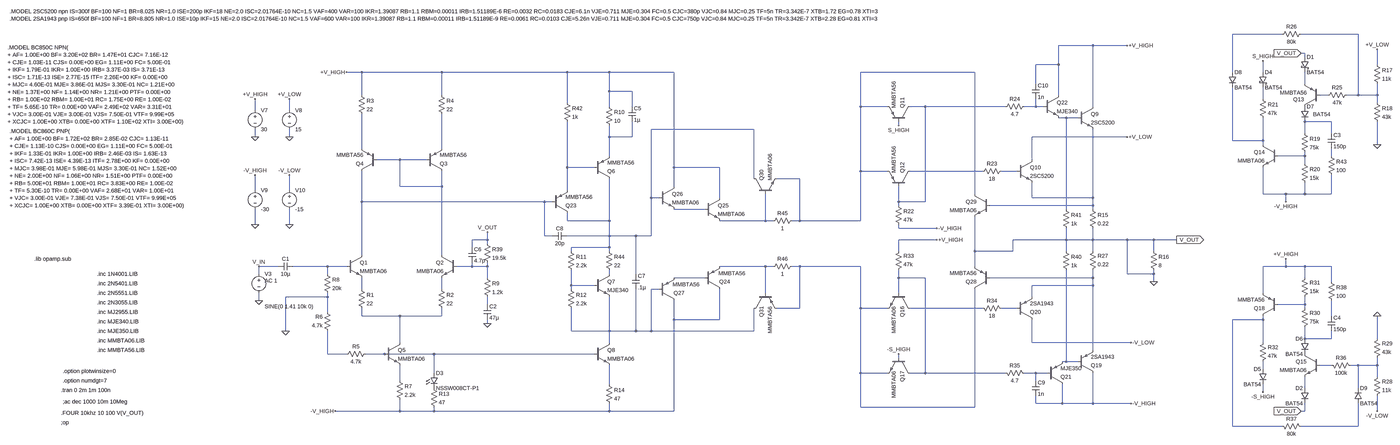
[diagram p0: schematic Limitador-Corriente.asc, whole sheet]
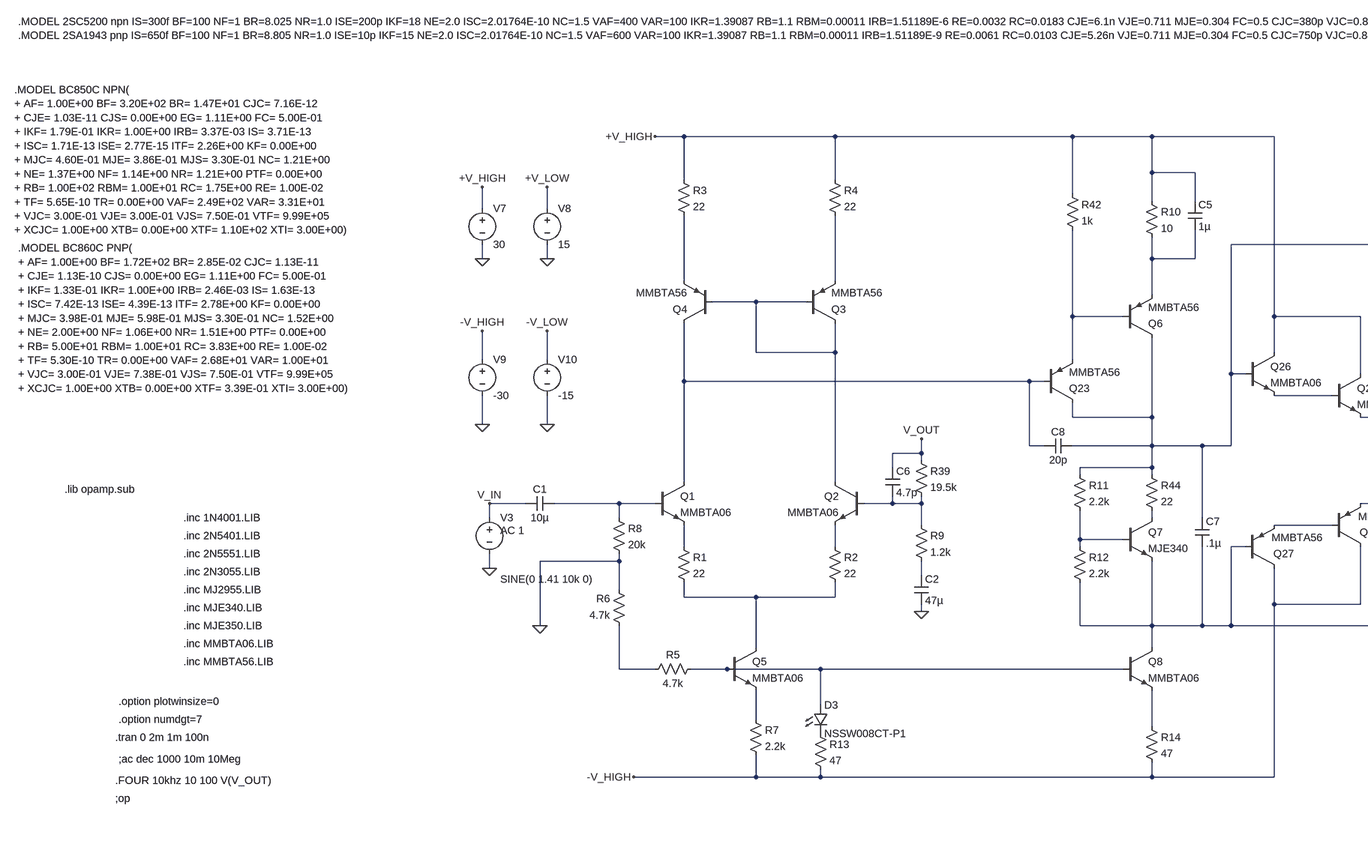
[diagram p1: schematic Limitador-Corriente.asc, part, row 1 of 1, column 1 of 2]
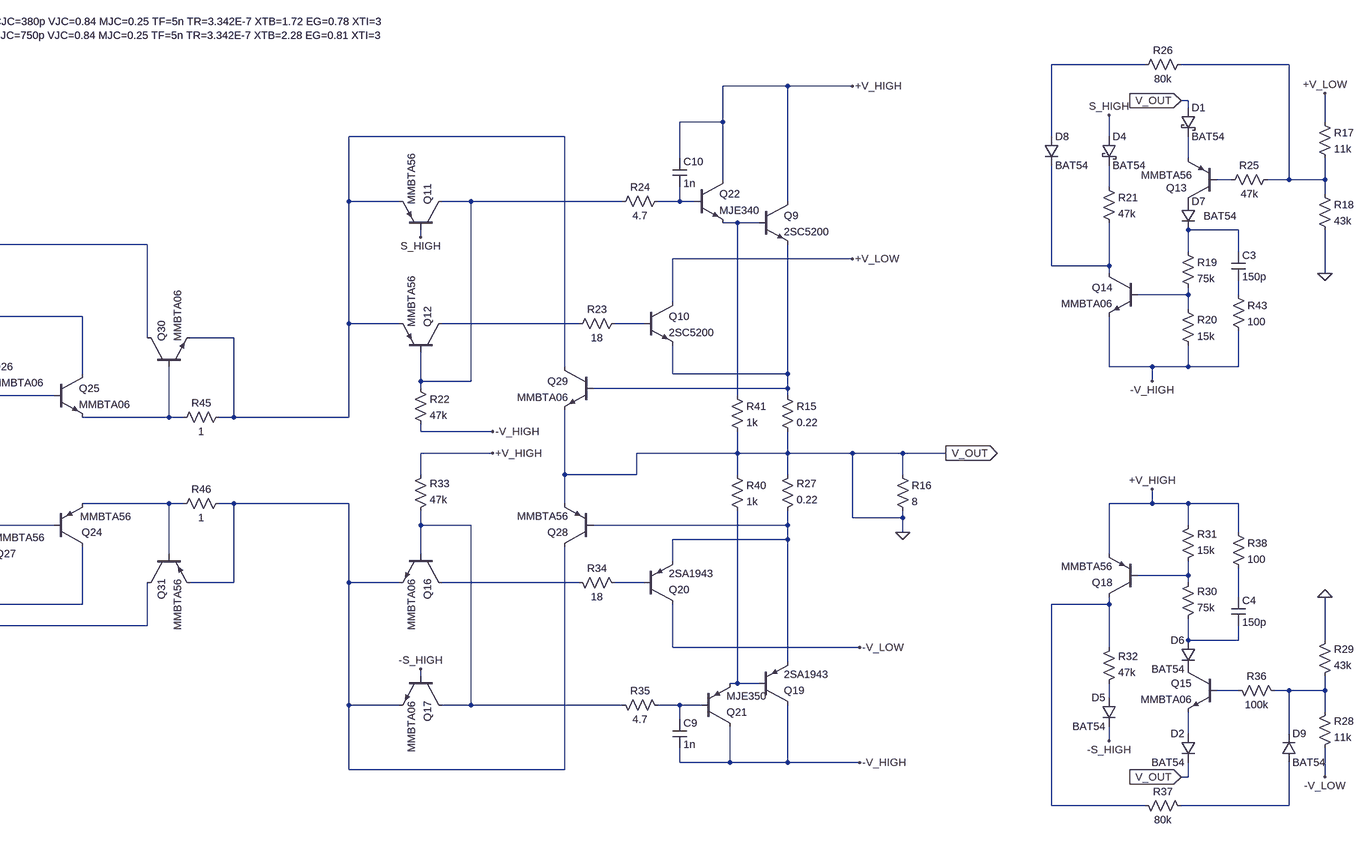
[diagram p2: schematic Limitador-Corriente.asc, part, row 1 of 1, column 2 of 2]
Limitador-Corriente.asc, the LTspice schematic file:
Version 4
SHEET 1 4660 2796
WIRE 4192 -784 3984 -784
WIRE 4512 -784 4272 -784
WIRE 3344 -736 3200 -736
WIRE 3488 -736 3344 -736
WIRE 4288 -704 4272 -704
WIRE 4288 -688 4288 -704
WIRE 3200 -656 3200 -736
WIRE 3200 -656 3104 -656
WIRE 4592 -656 4592 -720
WIRE 272 -624 208 -624
WIRE 608 -624 272 -624
WIRE 1136 -624 608 -624
WIRE 1312 -624 1136 -624
WIRE 1584 -624 1312 -624
WIRE 2848 -624 2368 -624
WIRE 3984 -624 3984 -784
WIRE 4112 -624 4112 -672
WIRE 3104 -576 3104 -656
WIRE 4288 -576 4288 -624
WIRE 1312 -544 1312 -624
WIRE 1408 -544 1312 -544
WIRE 272 -528 272 -624
WIRE 608 -528 608 -624
WIRE 3200 -528 3200 -656
WIRE 4384 -528 4352 -528
WIRE 4512 -528 4512 -784
WIRE 4512 -528 4464 -528
WIRE 4592 -528 4592 -576
WIRE 4592 -528 4512 -528
WIRE 4112 -512 4112 -560
WIRE 1136 -496 1136 -624
WIRE 4592 -496 4592 -528
WIRE 1312 -480 1312 -544
WIRE 1408 -480 1408 -544
WIRE 2368 -480 2368 -624
WIRE 2480 -480 2368 -480
WIRE 2640 -480 2576 -480
WIRE 2976 -480 2640 -480
WIRE 3104 -480 3104 -512
WIRE 3104 -480 3056 -480
WIRE 3136 -480 3104 -480
WIRE 3344 -480 3344 -736
WIRE -176 -464 -176 -512
WIRE -32 -464 -32 -512
WIRE 3232 -432 3200 -432
WIRE 3280 -432 3232 -432
WIRE 4400 -416 4288 -416
WIRE 2528 -400 2528 -416
WIRE 1920 -384 1488 -384
WIRE 4288 -368 4288 -416
WIRE 4400 -368 4400 -416
WIRE -176 -352 -176 -384
WIRE -32 -352 -32 -384
WIRE 1312 -352 1312 -400
WIRE 1408 -352 1408 -416
WIRE 1408 -352 1312 -352
WIRE 3488 -352 3088 -352
WIRE 3984 -336 3984 -560
WIRE 4112 -336 4112 -432
WIRE 4112 -336 3984 -336
WIRE 4112 -320 4112 -336
WIRE 4592 -320 4592 -416
WIRE 272 -304 272 -448
WIRE 608 -304 608 -448
WIRE 1312 -272 1312 -352
WIRE 4288 -272 4288 -288
WIRE 4288 -272 4176 -272
WIRE 4400 -272 4400 -304
WIRE 432 -256 336 -256
WIRE 544 -256 432 -256
WIRE 3088 -256 3088 -352
WIRE 4288 -240 4288 -272
WIRE 1136 -224 1136 -416
WIRE 1248 -224 1136 -224
WIRE 1584 -224 1584 -624
WIRE 1776 -224 1584 -224
WIRE 2368 -208 2368 -480
WIRE 2480 -208 2368 -208
WIRE 2880 -208 2576 -208
WIRE 3024 -208 2960 -208
WIRE 1920 -176 1920 -384
WIRE 2112 -176 2016 -176
WIRE 432 -144 432 -256
WIRE 608 -144 608 -208
WIRE 608 -144 432 -144
WIRE 1584 -144 1584 -224
WIRE -176 -128 -176 -192
WIRE -32 -128 -32 -192
WIRE 1136 -128 1136 -224
WIRE 2848 -112 2848 -624
WIRE 4112 -112 4112 -224
WIRE 4208 -112 4112 -112
WIRE 4288 -112 4288 -160
WIRE 4288 -112 4208 -112
WIRE 4400 -112 4400 -192
WIRE 4400 -112 4288 -112
WIRE 1488 -96 1488 -384
WIRE 1520 -96 1488 -96
WIRE 1776 -96 1776 -224
WIRE 3088 -96 3088 -160
WIRE 3344 -96 3344 -384
WIRE 3344 -96 3088 -96
WIRE 272 -80 272 -208
WIRE 1040 -80 272 -80
WIRE 1072 -80 1040 -80
WIRE 2528 -80 2528 -144
WIRE 2640 -80 2640 -480
WIRE 2640 -80 2528 -80
WIRE 4208 -80 4208 -112
WIRE 2528 -64 2528 -80
WIRE 3344 -64 3344 -96
WIRE 3344 -64 2912 -64
WIRE 1712 -48 1584 -48
WIRE 3232 -48 3232 -432
WIRE 3344 -48 3344 -64
WIRE 1136 0 1136 -32
WIRE 1312 0 1312 -176
WIRE 1312 0 1136 0
WIRE 1968 0 1968 -112
WIRE 1968 0 1776 0
WIRE 2000 0 1968 0
WIRE 2112 0 2112 -176
WIRE 2112 0 2080 0
WIRE 2368 0 2368 -208
WIRE 2368 0 2112 0
WIRE -176 16 -176 -48
WIRE -32 16 -32 -48
WIRE 2528 32 2528 16
WIRE 2688 32 2528 32
WIRE 1040 64 1040 -80
WIRE 1072 64 1040 64
WIRE 1312 64 1312 0
WIRE 1312 64 1136 64
WIRE 1424 64 1312 64
WIRE 1488 64 1488 -96
WIRE 1488 64 1424 64
WIRE 800 80 800 48
WIRE 800 80 736 80
WIRE 2688 80 2528 80
WIRE 3232 80 3232 32
WIRE 3232 80 3008 80
WIRE 3344 80 3344 32
WIRE 3344 80 3232 80
WIRE 3488 80 3344 80
WIRE 3600 80 3488 80
WIRE 3696 80 3600 80
WIRE 800 96 800 80
WIRE 736 112 736 80
WIRE 1312 112 1312 64
WIRE 1312 112 1152 112
WIRE 1152 128 1152 112
WIRE 1312 128 1312 112
WIRE 2528 128 2528 80
WIRE 2848 128 2848 -16
WIRE 3008 128 3008 80
WIRE 3008 128 2848 128
WIRE 3232 128 3232 80
WIRE 3344 128 3344 80
WIRE 3600 128 3600 80
WIRE 272 144 272 -80
WIRE 608 144 608 -144
WIRE -80 192 -160 192
WIRE 128 192 -16 192
WIRE 208 192 128 192
WIRE 736 192 736 176
WIRE 736 192 672 192
WIRE 800 192 800 176
WIRE 800 192 736 192
WIRE 1968 192 1776 192
WIRE 2000 192 1968 192
WIRE 2112 192 2080 192
WIRE 2368 192 2112 192
WIRE 2848 192 2848 128
WIRE 4208 192 4208 160
WIRE 4208 192 4112 192
WIRE 4288 192 4208 192
WIRE 4400 192 4288 192
WIRE -160 224 -160 192
WIRE 128 224 128 192
WIRE 1312 224 1312 208
WIRE 1424 224 1424 64
WIRE 3488 224 3488 80
WIRE 3600 224 3600 208
WIRE 3600 224 3488 224
WIRE 800 240 800 192
WIRE 1712 240 1584 240
WIRE 2528 240 2528 208
WIRE 2640 240 2528 240
WIRE 3344 240 3344 208
WIRE 3344 240 2912 240
WIRE 4288 240 4288 192
WIRE 3600 256 3600 224
WIRE 4400 256 4400 192
WIRE 1152 272 1152 208
WIRE 1248 272 1152 272
WIRE 3344 272 3344 240
WIRE 3344 272 3088 272
WIRE 272 288 272 240
WIRE 608 288 608 240
WIRE 1152 288 1152 272
WIRE 1520 288 1488 288
WIRE 1968 304 1968 192
WIRE 2528 304 2528 240
WIRE 4112 304 4112 192
WIRE 128 320 128 304
WIRE 128 320 -48 320
WIRE 3088 320 3088 272
WIRE -160 336 -160 304
WIRE 800 352 800 320
WIRE 4288 352 4288 320
WIRE 4288 352 4176 352
WIRE 2112 368 2112 192
WIRE 2112 368 2016 368
WIRE 2368 368 2368 192
WIRE 2480 368 2368 368
WIRE 2880 368 2576 368
WIRE 3024 368 2960 368
WIRE 4288 368 4288 352
WIRE 128 384 128 320
WIRE 272 400 272 368
WIRE 432 400 272 400
WIRE 608 400 608 368
WIRE 608 400 432 400
WIRE 4400 400 4400 336
WIRE 1584 416 1584 336
WIRE 1776 416 1776 288
WIRE 1776 416 1584 416
WIRE 4112 416 4112 400
WIRE 4112 416 3984 416
WIRE 800 432 800 416
WIRE -48 464 -48 320
WIRE 1152 464 1152 368
WIRE 1312 464 1312 320
WIRE 1312 464 1152 464
WIRE 1424 464 1424 288
WIRE 1424 464 1312 464
WIRE 1488 464 1488 288
WIRE 1488 464 1424 464
WIRE 1920 464 1920 368
WIRE 1920 464 1488 464
WIRE 4288 496 4288 448
WIRE 4400 496 4400 464
WIRE 4400 496 4288 496
WIRE 4592 496 4592 400
WIRE 432 512 432 400
WIRE 1312 512 1312 464
WIRE 3088 512 3088 416
WIRE 3504 512 3088 512
WIRE 4112 512 4112 416
WIRE 3344 544 3344 272
WIRE 128 560 128 464
WIRE 208 560 128 560
WIRE 368 560 288 560
WIRE 576 560 368 560
WIRE 1248 560 576 560
WIRE 2528 576 2528 560
WIRE 3232 592 3232 208
WIRE 3232 592 3216 592
WIRE 3280 592 3232 592
WIRE 4400 608 4352 608
WIRE 4512 608 4480 608
WIRE 4592 608 4592 576
WIRE 4592 608 4512 608
WIRE 4112 624 4112 592
WIRE 576 640 576 560
WIRE 2368 640 2368 368
WIRE 2480 640 2368 640
WIRE 2640 640 2640 240
WIRE 2640 640 2576 640
WIRE 2976 640 2640 640
WIRE 3104 640 3056 640
WIRE 3152 640 3104 640
WIRE 4592 656 4592 608
WIRE 432 672 432 608
WIRE 3104 672 3104 640
WIRE 1312 688 1312 608
WIRE 4288 704 4288 656
WIRE 4512 704 4512 608
WIRE 4112 720 4112 688
WIRE 3104 768 3104 736
WIRE 3216 768 3216 688
WIRE 3216 768 3104 768
WIRE 3344 768 3344 640
WIRE 3344 768 3216 768
WIRE 3504 768 3344 768
WIRE 2368 784 2368 640
WIRE 2848 784 2848 288
WIRE 2848 784 2368 784
WIRE 432 800 432 752
WIRE 432 800 160 800
WIRE 576 800 576 784
WIRE 576 800 432 800
WIRE 1312 800 1312 768
WIRE 1312 800 576 800
WIRE 1584 800 1584 416
WIRE 1584 800 1312 800
WIRE 4288 800 4288 768
WIRE 4288 800 4272 800
WIRE 4592 800 4592 736
WIRE 3984 864 3984 416
WIRE 4192 864 3984 864
WIRE 4512 864 4512 768
WIRE 4512 864 4272 864
FLAG -48 464 0
FLAG 800 432 0
FLAG -160 336 0
FLAG 3488 -736 +V_HIGH
FLAG 3488 -352 +V_LOW
FLAG 3600 256 0
FLAG 4592 -320 0
FLAG 4592 -720 +V_LOW
FLAG 3696 80 V_OUT
IOPIN 3696 80 Out
FLAG 4272 -704 V_OUT
IOPIN 4272 -704 In
FLAG 4208 -80 -V_HIGH
FLAG 2528 -400 S_HIGH
FLAG 4112 -672 S_HIGH
FLAG 2688 32 -V_HIGH
FLAG 3504 768 -V_HIGH
FLAG 3504 512 -V_LOW
FLAG 4592 400 0
FLAG 4592 800 -V_LOW
FLAG 4272 800 V_OUT
IOPIN 4272 800 In
FLAG 4208 160 +V_HIGH
FLAG 2528 560 -S_HIGH
FLAG 4112 720 -S_HIGH
FLAG 2688 80 +V_HIGH
FLAG -176 -352 0
FLAG -32 -352 0
FLAG -176 -512 +V_HIGH
FLAG -32 -512 +V_LOW
FLAG -176 16 0
FLAG -32 16 0
FLAG -176 -192 -V_HIGH
FLAG -32 -192 -V_LOW
FLAG 208 -624 +V_HIGH
FLAG 160 800 -V_HIGH
FLAG 800 48 V_OUT
FLAG -160 192 V_IN
SYMBOL npn 208 144 R0
SYMATTR InstName Q1
SYMATTR Value MMBTA06
SYMBOL npn 672 144 M0
SYMATTR InstName Q2
SYMATTR Value MMBTA06
SYMBOL pnp 544 -208 M180
SYMATTR InstName Q3
SYMATTR Value MMBTA56
SYMBOL pnp 336 -208 R180
SYMATTR InstName Q4
SYMATTR Value MMBTA56
SYMBOL res 256 272 R0
SYMATTR InstName R1
SYMATTR Value 22
SYMBOL res 592 272 R0
SYMATTR InstName R2
SYMATTR Value 22
SYMBOL res 256 -544 R0
SYMATTR InstName R3
SYMATTR Value 22
SYMBOL res 592 -544 R0
SYMATTR InstName R4
SYMATTR Value 22
SYMBOL npn 368 512 R0
SYMATTR InstName Q5
SYMATTR Value MMBTA06
SYMBOL res 304 544 R90
WINDOW 0 0 56 VBottom 2
WINDOW 3 32 56 VTop 2
SYMATTR InstName R5
SYMATTR Value 4.7k
SYMBOL res 144 480 R180
WINDOW 0 36 76 Left 2
WINDOW 3 36 40 Left 2
SYMATTR InstName R6
SYMATTR Value 4.7k
SYMBOL res 416 656 R0
SYMATTR InstName R7
SYMATTR Value 2.2k
SYMBOL res 112 208 R0
SYMATTR InstName R8
SYMATTR Value 20k
SYMBOL res 784 224 R0
SYMATTR InstName R9
SYMATTR Value 1.2k
SYMBOL cap -16 176 R90
WINDOW 0 0 32 VBottom 2
WINDOW 3 32 32 VTop 2
SYMATTR InstName C1
SYMATTR Value 10µ
SYMBOL voltage -160 208 R0
WINDOW 3 24 152 Left 2
WINDOW 123 24 44 Left 2
WINDOW 39 0 0 Left 0
SYMATTR Value SINE(0 1.41 10k 0)
SYMATTR Value2 AC 1
SYMATTR InstName V3
SYMBOL pnp 1248 -176 M180
SYMATTR InstName Q6
SYMATTR Value MMBTA56
SYMBOL res 1296 -496 R0
SYMATTR InstName R10
SYMATTR Value 10
SYMBOL npn 1248 224 R0
SYMATTR InstName Q7
SYMATTR Value MJE340
SYMBOL res 1136 112 R0
SYMATTR InstName R11
SYMATTR Value 2.2k
SYMBOL res 1136 272 R0
SYMATTR InstName R12
SYMATTR Value 2.2k
SYMBOL npn 1248 512 R0
SYMATTR InstName Q8
SYMATTR Value MMBTA06
SYMBOL res 1296 672 R0
SYMATTR InstName R14
SYMATTR Value 47
SYMBOL cap 784 352 R0
SYMATTR InstName C2
SYMATTR Value 47µ
SYMBOL npn 3280 -480 R0
SYMATTR InstName Q9
SYMATTR Value 2SC5200
SYMBOL npn 3024 -256 R0
SYMATTR InstName Q10
SYMATTR Value 2SC5200
SYMBOL res 3328 -64 R0
SYMATTR InstName R15
SYMATTR Value 0.22
SYMBOL pnp 2576 -416 M270
SYMATTR InstName Q11
SYMATTR Value MMBTA56
SYMBOL pnp 2576 -144 M270
SYMATTR InstName Q12
SYMATTR Value MMBTA56
SYMBOL res 3584 112 R0
SYMATTR InstName R16
SYMATTR Value 8
SYMBOL res 4576 -672 R0
SYMATTR InstName R17
SYMATTR Value 11k
SYMBOL res 4576 -512 R0
SYMATTR InstName R18
SYMATTR Value 43k
SYMBOL pnp 4352 -480 R180
WINDOW 0 67 30 Left 2
WINDOW 3 55 58 Left 2
SYMATTR InstName Q13
SYMATTR Value MMBTA56
SYMBOL res 4272 -384 R0
SYMATTR InstName R19
SYMATTR Value 75k
SYMBOL res 4272 -256 R0
SYMATTR InstName R20
SYMATTR Value 15k
SYMBOL npn 4176 -320 M0
SYMATTR InstName Q14
SYMATTR Value MMBTA06
SYMBOL res 4096 -528 R0
SYMATTR InstName R21
SYMATTR Value 47k
SYMBOL res 2512 -80 R0
SYMATTR InstName R22
SYMATTR Value 47k
SYMBOL cap 4384 -368 R0
SYMATTR InstName C3
SYMATTR Value 150p
SYMBOL schottky 4272 -688 R0
SYMATTR InstName D1
SYMATTR Value BAT54
SYMATTR Description Diode
SYMATTR Type diode
SYMBOL res 2976 -224 R90
WINDOW 0 0 56 VBottom 2
WINDOW 3 32 56 VTop 2
SYMATTR InstName R23
SYMATTR Value 18
SYMBOL res 3072 -496 R90
WINDOW 0 0 56 VBottom 2
WINDOW 3 32 56 VTop 2
SYMATTR InstName R24
SYMATTR Value 4.7
SYMBOL res 4480 -544 R90
WINDOW 0 0 56 VBottom 2
WINDOW 3 32 56 VTop 2
SYMATTR InstName R25
SYMATTR Value 47k
SYMBOL res 4288 -800 R90
WINDOW 0 0 56 VBottom 2
WINDOW 3 32 56 VTop 2
SYMATTR InstName R26
SYMATTR Value 80k
SYMBOL res 3328 224 M180
WINDOW 0 36 76 Left 2
WINDOW 3 36 40 Left 2
SYMATTR InstName R27
SYMATTR Value 0.22
SYMBOL res 4576 752 M180
WINDOW 0 36 76 Left 2
WINDOW 3 36 40 Left 2
SYMATTR InstName R28
SYMATTR Value 11k
SYMBOL res 4576 592 M180
WINDOW 0 36 76 Left 2
WINDOW 3 36 40 Left 2
SYMATTR InstName R29
SYMATTR Value 43k
SYMBOL res 4272 464 M180
WINDOW 0 36 76 Left 2
WINDOW 3 36 40 Left 2
SYMATTR InstName R30
SYMATTR Value 75k
SYMBOL res 4272 336 M180
WINDOW 0 36 76 Left 2
WINDOW 3 36 40 Left 2
SYMATTR InstName R31
SYMATTR Value 15k
SYMBOL res 4096 608 M180
WINDOW 0 36 76 Left 2
WINDOW 3 36 40 Left 2
SYMATTR InstName R32
SYMATTR Value 47k
SYMBOL res 2512 224 M180
WINDOW 0 36 76 Left 2
WINDOW 3 36 40 Left 2
SYMATTR InstName R33
SYMATTR Value 47k
SYMBOL cap 4384 464 M180
WINDOW 0 24 56 Left 2
WINDOW 3 24 8 Left 2
SYMATTR InstName C4
SYMATTR Value 150p
SYMBOL diode 4304 704 M0
SYMATTR InstName D2
SYMATTR Value BAT54
SYMBOL res 2976 384 M270
WINDOW 0 32 56 VTop 2
WINDOW 3 0 56 VBottom 2
SYMATTR InstName R34
SYMATTR Value 18
SYMBOL res 3072 656 M270
WINDOW 0 32 56 VTop 2
WINDOW 3 0 56 VBottom 2
SYMATTR InstName R35
SYMATTR Value 4.7
SYMBOL res 4496 624 M270
WINDOW 0 32 56 VTop 2
WINDOW 3 0 56 VBottom 2
SYMATTR InstName R36
SYMATTR Value 100k
SYMBOL res 4288 880 M270
WINDOW 0 32 56 VTop 2
WINDOW 3 0 56 VBottom 2
SYMATTR InstName R37
SYMATTR Value 80k
SYMBOL npn 4352 560 M0
SYMATTR InstName Q15
SYMATTR Value MMBTA06
SYMBOL npn 2576 304 R90
SYMATTR InstName Q16
SYMATTR Value MMBTA06
SYMBOL npn 2576 576 R90
SYMATTR InstName Q17
SYMATTR Value MMBTA06
SYMBOL pnp 4176 400 R180
SYMATTR InstName Q18
SYMATTR Value MMBTA56
SYMBOL pnp 3280 640 M180
SYMATTR InstName Q19
SYMATTR Value 2SA1943
SYMBOL pnp 3024 416 M180
SYMATTR InstName Q20
SYMATTR Value 2SA1943
SYMBOL voltage -176 -480 R0
WINDOW 123 0 0 Left 0
WINDOW 39 0 0 Left 0
SYMATTR InstName V7
SYMATTR Value 30
SYMBOL voltage -32 -480 R0
WINDOW 123 0 0 Left 0
WINDOW 39 0 0 Left 0
SYMATTR InstName V8
SYMATTR Value 15
SYMBOL voltage -176 -144 R0
WINDOW 123 0 0 Left 0
WINDOW 39 0 0 Left 0
SYMATTR InstName V9
SYMATTR Value -30
SYMBOL voltage -32 -144 R0
WINDOW 123 0 0 Left 0
WINDOW 39 0 0 Left 0
SYMATTR InstName V10
SYMATTR Value -15
SYMBOL res 784 80 R0
SYMATTR InstName R39
SYMATTR Value 19.5k
SYMBOL LED 560 640 R0
SYMATTR InstName D3
SYMATTR Value NSSW008CT-P1
SYMBOL cap 1392 -480 R0
SYMATTR InstName C5
SYMATTR Value 1µ
SYMBOL pnp 3152 688 M180
SYMATTR InstName Q21
SYMATTR Value MJE350
SYMBOL res 3216 112 R0
SYMATTR InstName R40
SYMATTR Value 1k
SYMBOL npn 3136 -528 R0
SYMATTR InstName Q22
SYMATTR Value MJE340
SYMBOL res 3216 -64 R0
SYMATTR InstName R41
SYMATTR Value 1k
SYMBOL res 560 688 R0
SYMATTR InstName R13
SYMATTR Value 47
SYMBOL cap 720 112 R0
SYMATTR InstName C6
SYMATTR Value 4.7p
SYMBOL pnp 1072 -32 M180
SYMATTR InstName Q23
SYMATTR Value MMBTA56
SYMBOL res 1120 -512 R0
SYMATTR InstName R42
SYMATTR Value 1k
SYMBOL cap 1136 48 R90
WINDOW 0 0 32 VBottom 2
WINDOW 3 32 32 VTop 2
SYMATTR InstName C8
SYMATTR Value 20p
SYMBOL cap 1408 224 R0
SYMATTR InstName C7
SYMATTR Value .1µ
SYMBOL schottky 4096 -624 R0
SYMATTR InstName D4
SYMATTR Value BAT54
SYMATTR Description Diode
SYMATTR Type diode
SYMBOL diode 4128 624 M0
SYMATTR InstName D5
SYMATTR Value BAT54
SYMBOL diode 4304 496 M0
SYMATTR InstName D6
SYMATTR Value BAT54
SYMBOL diode 4272 -480 R0
WINDOW 3 50 33 Left 2
SYMATTR Value BAT54
SYMATTR InstName D7
SYMBOL diode 3968 -624 R0
SYMATTR InstName D8
SYMATTR Value BAT54
SYMBOL diode 4496 768 M180
WINDOW 0 24 64 Left 2
WINDOW 3 24 0 Left 2
SYMATTR InstName D9
SYMATTR Value BAT54
SYMBOL pnp 1712 288 M180
WINDOW 0 62 32 Left 2
WINDOW 3 59 67 Left 2
SYMATTR InstName Q24
SYMATTR Value MMBTA56
SYMBOL npn 1712 -96 R0
SYMATTR InstName Q25
SYMATTR Value MMBTA06
SYMBOL npn 1520 -144 R0
SYMATTR InstName Q26
SYMATTR Value MMBTA06
SYMBOL pnp 1520 336 M180
WINDOW 0 62 32 Left 2
WINDOW 3 58 68 Left 2
SYMATTR InstName Q27
SYMATTR Value MMBTA56
SYMBOL res 1296 112 R0
SYMATTR InstName R44
SYMATTR Value 22
SYMBOL pnp 2912 288 R180
SYMATTR InstName Q28
SYMATTR Value MMBTA56
SYMBOL npn 2912 -112 M0
SYMATTR InstName Q29
SYMATTR Value MMBTA06
SYMBOL res 4384 240 R0
SYMATTR InstName R38
SYMATTR Value 100
SYMBOL res 4384 -288 R0
SYMATTR InstName R43
SYMATTR Value 100
SYMBOL cap 3088 672 R0
SYMATTR InstName C9
SYMATTR Value 1n
SYMBOL cap 3088 -576 R0
SYMATTR InstName C10
SYMATTR Value 1n
SYMBOL npn 1920 -112 R270
SYMATTR InstName Q30
SYMATTR Value MMBTA06
SYMBOL pnp 1920 304 M90
SYMATTR InstName Q31
SYMATTR Value MMBTA56
SYMBOL res 2096 -16 R90
WINDOW 0 0 56 VBottom 2
WINDOW 3 32 56 VTop 2
SYMATTR InstName R45
SYMATTR Value 1
SYMBOL res 2096 176 R90
WINDOW 0 0 56 VBottom 2
WINDOW 3 32 56 VTop 2
SYMATTR InstName R46
SYMATTR Value 1
TEXT -992 712 Left 2 !.tran 0 2m 1m 100n
TEXT -992 808 Left 2 !.FOUR 10khz 10 100 V(V_OUT)
TEXT -840 384 Left 2 !.inc MJ2955.LIB
TEXT -840 344 Left 2 !.inc 2N3055.LIB
TEXT -840 304 Left 2 !.inc 2N5551.LIB
TEXT -840 264 Left 2 !.inc 2N5401.LIB
TEXT -840 224 Left 2 !.inc 1N4001.LIB
TEXT -1216 -728 Left 2 !.MODEL BC850C NPN(\n+ AF= 1.00E+00 BF= 3.20E+02 BR= 1.47E+01 CJC= 7.16E-12\n+ CJE= 1.03E-11 CJS= 0.00E+00 EG= 1.11E+00 FC= 5.00E-01\n+ IKF= 1.79E-01 IKR= 1.00E+00 IRB= 3.37E-03 IS= 3.71E-13\n+ ISC= 1.71E-13 ISE= 2.77E-15 ITF= 2.26E+00 KF= 0.00E+00\n+ MJC= 4.60E-01 MJE= 3.86E-01 MJS= 3.30E-01 NC= 1.21E+00\n+ NE= 1.37E+00 NF= 1.14E+00 NR= 1.21E+00 PTF= 0.00E+00\n+ RB= 1.00E+02 RBM= 1.00E+01 RC= 1.75E+00 RE= 1.00E-02\n+ TF= 5.65E-10 TR= 0.00E+00 VAF= 2.49E+02 VAR= 3.31E+01\n+ VJC= 3.00E-01 VJE= 3.00E-01 VJS= 7.50E-01 VTF= 9.99E+05\n+ XCJC= 1.00E+00 XTB= 0.00E+00 XTF= 1.10E+02 XTI= 3.00E+00)
TEXT -1208 -376 Left 2 !.MODEL BC860C PNP(\n+ AF= 1.00E+00 BF= 1.72E+02 BR= 2.85E-02 CJC= 1.13E-11\n+ CJE= 1.13E-10 CJS= 0.00E+00 EG= 1.11E+00 FC= 5.00E-01\n+ IKF= 1.33E-01 IKR= 1.00E+00 IRB= 2.46E-03 IS= 1.63E-13\n+ ISC= 7.42E-13 ISE= 4.39E-13 ITF= 2.78E+00 KF= 0.00E+00\n+ MJC= 3.98E-01 MJE= 5.98E-01 MJS= 3.30E-01 NC= 1.52E+00\n+ NE= 2.00E+00 NF= 1.06E+00 NR= 1.51E+00 PTF= 0.00E+00\n+ RB= 5.00E+01 RBM= 1.00E+01 RC= 3.83E+00 RE= 1.00E-02\n+ TF= 5.30E-10 TR= 0.00E+00 VAF= 2.68E+01 VAR= 1.00E+01\n+ VJC= 3.00E-01 VJE= 7.38E-01 VJS= 7.50E-01 VTF= 9.99E+05\n+ XCJC= 1.00E+00 XTB= 0.00E+00 XTF= 3.39E-01 XTI= 3.00E+00)
TEXT -1104 160 Left 2 !.lib opamp.sub
TEXT -984 760 Left 2 !;ac dec 1000 10m 10Meg
TEXT -992 848 Left 2 !;op
TEXT -984 672 Left 2 !.option numdgt=7
TEXT -840 424 Left 2 !.inc MJE340.LIB
TEXT -840 464 Left 2 !.inc MJE350.LIB
TEXT -840 504 Left 2 !.inc MMBTA06.LIB
TEXT -840 544 Left 2 !.inc MMBTA56.LIB
TEXT -984 632 Left 2 !.option plotwinsize=0
TEXT -1208 -880 Left 2 !.MODEL 2SC5200 npn IS=300f BF=100 NF=1 BR=8.025 NR=1.0 ISE=200p IKF=18 NE=2.0 ISC=2.01764E-10 NC=1.5 VAF=400 VAR=100 IKR=1.39087 RB=1.1 RBM=0.00011 IRB=1.51189E-6 RE=0.0032 RC=0.0183 CJE=6.1n VJE=0.711 MJE=0.304 FC=0.5 CJC=380p VJC=0.84 MJC=0.25 TF=5n TR=3.342E-7 XTB=1.72 EG=0.78 XTI=3\n.MODEL 2SA1943 pnp IS=650f BF=100 NF=1 BR=8.805 NR=1.0 ISE=10p IKF=15 NE=2.0 ISC=2.01764E-10 NC=1.5 VAF=600 VAR=100 IKR=1.39087 RB=1.1 RBM=0.00011 IRB=1.51189E-9 RE=0.0061 RC=0.0103 CJE=5.26n VJE=0.711 MJE=0.304 FC=0.5 CJC=750p VJC=0.84 MJC=0.25 TF=5n TR=3.342E-7 XTB=2.28 EG=0.81 XTI=3

The netlist it stands for:
* Limitador-Corriente.asc
Q1 N023 N026 N035 0 MMBTA06
Q2 N018 N027 N036 0 MMBTA06
Q3 N018 N018 N015 0 MMBTA56
Q4 N023 N018 N014 0 MMBTA56
R1 N035 N042 22
R2 N036 N042 22
R3 +V_HIGH N014 22
R4 +V_HIGH N015 22
Q5 N042 N047 N053 0 MMBTA06
R5 N047 N046 4.7k
R6 N046 0 4.7k
R7 N053 -V_HIGH 2.2k
R8 N026 0 20k
R9 N027 N038 1.2k
C1 N026 V_IN 10µ
V3 V_IN 0 SINE(0 1.41 10k 0) AC 1
Q6 N011 N019 N012 0 MMBTA56
R10 +V_HIGH N012 10
Q7 N030 N034 N037 0 MJE340
R11 N011 N034 2.2k
R12 N034 N037 2.2k
Q8 N037 N047 N054 0 MMBTA06
R14 N054 -V_HIGH 47
C2 N038 0 47µ
Q9 +V_HIGH N009 N022 0 2SC5200
Q10 +V_LOW N021 N022 0 2SC5200
R15 N022 0 0.22
Q11 N007 S_HIGH N003 0 MMBTA56
Q12 N020 N007 N003 0 MMBTA56
R16 0 0 8
R17 +V_LOW N002 11k
R18 N002 0 43k
Q13 P001 N005 N004 0 MMBTA56
R19 N010 N016 75k
R20 N016 -V_HIGH 15k
Q14 N013 N016 -V_HIGH 0 MMBTA06
R21 N006 N013 47k
R22 N007 -V_HIGH 47k
C3 N010 N017 150p
D1 0 N004 BAT54
R23 N021 N020 18
R24 N008 N007 4.7
R25 N002 N005 47k
R26 N002 N001 80k
R27 N033 0 0.22
R28 -V_LOW N050 11k
R29 N050 0 43k
R30 N045 N039 75k
R31 N039 +V_HIGH 15k
R32 N051 N044 47k
R33 N032 +V_HIGH 47k
C4 N045 N043 150p
D2 N055 0 BAT54
R34 N041 N040 18
R35 N052 N032 4.7
R36 N050 N049 100k
R37 N056 N044 80k
Q15 P002 N049 N055 0 MMBTA06
Q16 N040 N032 N029 0 MMBTA06
Q17 N032 -S_HIGH N029 0 MMBTA06
Q18 N044 N039 +V_HIGH 0 MMBTA56
Q19 -V_HIGH N048 N033 0 2SA1943
Q20 -V_LOW N041 N033 0 2SA1943
V7 +V_HIGH 0 30
V8 +V_LOW 0 15
V9 -V_HIGH 0 -30
V10 -V_LOW 0 -15
R39 0 N027 19.5k
D3 N047 P003 NSSW008CT-P1
C5 +V_HIGH N012 1µ
Q21 -V_HIGH N052 N048 0 MJE350
R40 0 N048 1k
Q22 +V_HIGH N008 N009 0 MJE340
R41 N009 0 1k
R13 P003 -V_HIGH 47
C6 0 N027 4.7p
Q23 N011 N023 N019 0 MMBTA56
R42 +V_HIGH N019 1k
C8 N011 N023 20p
C7 N011 N037 .1µ
D4 S_HIGH N006 BAT54
D5 N051 -S_HIGH BAT54
D6 N045 P002 BAT54
D7 P001 N010 BAT54
D8 N001 N013 BAT54
D9 N056 N050 BAT54
Q24 -V_HIGH N031 N028 0 MMBTA56
Q25 +V_HIGH N024 N025 0 MMBTA06
Q26 +V_HIGH N011 N024 0 MMBTA06
Q27 -V_HIGH N037 N031 0 MMBTA56
R44 N011 N030 22
Q28 N029 N033 0 0 MMBTA56
Q29 N003 N022 0 0 MMBTA06
R38 +V_HIGH N043 100
R43 N017 -V_HIGH 100
C9 N052 -V_HIGH 1n
C10 +V_HIGH N008 1n
Q30 N011 N025 N003 0 MMBTA06
Q31 N037 N028 N029 0 MMBTA56
R45 N003 N025 1
R46 N029 N028 1
.model D D
.lib standard.dio
.model NPN NPN
.model PNP PNP
.lib standard.bjt
.tran 0 2m 1m 100n
.FOUR 10khz 10 100 V(V_OUT)
.inc MJ2955.LIB
.inc 2N3055.LIB
.inc 2N5551.LIB
.inc 2N5401.LIB
.inc 1N4001.LIB
.MODEL BC850C NPN(
+ AF= 1.00E+00 BF= 3.20E+02 BR= 1.47E+01 CJC= 7.16E-12
+ CJE= 1.03E-11 CJS= 0.00E+00 EG= 1.11E+00 FC= 5.00E-01
+ IKF= 1.79E-01 IKR= 1.00E+00 IRB= 3.37E-03 IS= 3.71E-13
+ ISC= 1.71E-13 ISE= 2.77E-15 ITF= 2.26E+00 KF= 0.00E+00
+ MJC= 4.60E-01 MJE= 3.86E-01 MJS= 3.30E-01 NC= 1.21E+00
+ NE= 1.37E+00 NF= 1.14E+00 NR= 1.21E+00 PTF= 0.00E+00
+ RB= 1.00E+02 RBM= 1.00E+01 RC= 1.75E+00 RE= 1.00E-02
+ TF= 5.65E-10 TR= 0.00E+00 VAF= 2.49E+02 VAR= 3.31E+01
+ VJC= 3.00E-01 VJE= 3.00E-01 VJS= 7.50E-01 VTF= 9.99E+05
+ XCJC= 1.00E+00 XTB= 0.00E+00 XTF= 1.10E+02 XTI= 3.00E+00)
.MODEL BC860C PNP(
+ AF= 1.00E+00 BF= 1.72E+02 BR= 2.85E-02 CJC= 1.13E-11
+ CJE= 1.13E-10 CJS= 0.00E+00 EG= 1.11E+00 FC= 5.00E-01
+ IKF= 1.33E-01 IKR= 1.00E+00 IRB= 2.46E-03 IS= 1.63E-13
+ ISC= 7.42E-13 ISE= 4.39E-13 ITF= 2.78E+00 KF= 0.00E+00
+ MJC= 3.98E-01 MJE= 5.98E-01 MJS= 3.30E-01 NC= 1.52E+00
+ NE= 2.00E+00 NF= 1.06E+00 NR= 1.51E+00 PTF= 0.00E+00
+ RB= 5.00E+01 RBM= 1.00E+01 RC= 3.83E+00 RE= 1.00E-02
+ TF= 5.30E-10 TR= 0.00E+00 VAF= 2.68E+01 VAR= 1.00E+01
+ VJC= 3.00E-01 VJE= 7.38E-01 VJS= 7.50E-01 VTF= 9.99E+05
+ XCJC= 1.00E+00 XTB= 0.00E+00 XTF= 3.39E-01 XTI= 3.00E+00)
.lib opamp.sub
;ac dec 1000 10m 10Meg
;op
.option numdgt=7
.inc MJE340.LIB
.inc MJE350.LIB
.inc MMBTA06.LIB
.inc MMBTA56.LIB
.option plotwinsize=0
.MODEL 2SC5200 npn IS=300f BF=100 NF=1 BR=8.025 NR=1.0 ISE=200p IKF=18 NE=2.0 ISC=2.01764E-10 NC=1.5 VAF=400 VAR=100 IKR=1.39087 RB=1.1 RBM=0.00011 IRB=1.51189E-6 RE=0.0032 RC=0.0183 CJE=6.1n VJE=0.711 MJE=0.304 FC=0.5 CJC=380p VJC=0.84 MJC=0.25 TF=5n TR=3.342E-7 XTB=1.72 EG=0.78 XTI=3
.MODEL 2SA1943 pnp IS=650f BF=100 NF=1 BR=8.805 NR=1.0 ISE=10p IKF=15 NE=2.0 ISC=2.01764E-10 NC=1.5 VAF=600 VAR=100 IKR=1.39087 RB=1.1 RBM=0.00011 IRB=1.51189E-9 RE=0.0061 RC=0.0103 CJE=5.26n VJE=0.711 MJE=0.304 FC=0.5 CJC=750p VJC=0.84 MJC=0.25 TF=5n TR=3.342E-7 XTB=2.28 EG=0.81 XTI=3
.backanno
.end